# EasyEDA schematic memory-game.json
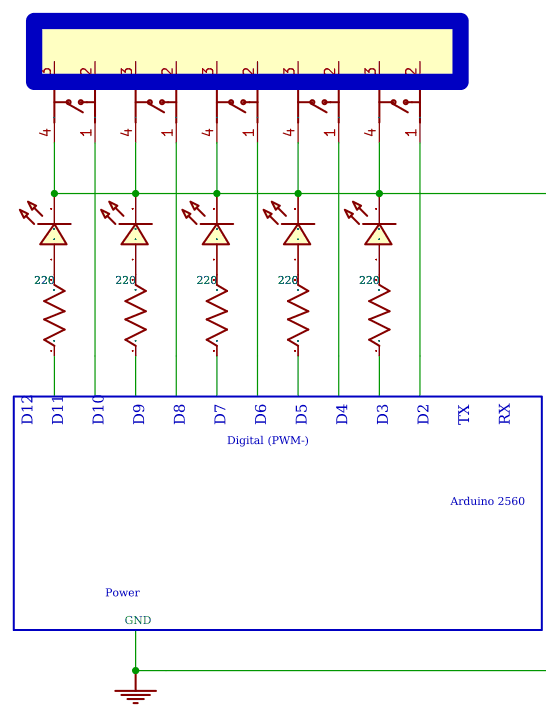
[diagram p0: schematic sheet]

## Parts
KEY1  button6*6*8  [KEY-TH_4P-L6.0-W6.0-P4.50-LS7.5]
KEY2  button6*6*8  [KEY-TH_4P-L6.0-W6.0-P4.50-LS7.5]
KEY3  button6*6*8  [KEY-TH_4P-L6.0-W6.0-P4.50-LS7.5]
KEY4  button6*6*8  [KEY-TH_4P-L6.0-W6.0-P4.50-LS7.5]
KEY5  button6*6*8  [KEY-TH_4P-L6.0-W6.0-P4.50-LS7.5]
LED1  LED-0603_R  [LED0603_RED]
LED2  LED-0603_R  [LED0603_RED]
LED3  LED-0603_R  [LED0603_RED]
LED4  LED-0603_R  [LED0603_RED]
LED5  LED-0603_R  [LED0603_RED]
R1  220  [R0603]
R2  220  [R0603]
R3  220  [R0603]
R4  220  [R0603]
R5  220  [R0603]

## Library data of the parts
KEY1-KEY5 = button6*6*8: Supplier Part: C59982; Supplier: LCSC; Manufacturer: ReliaPro
LED1-LED5 = LED-0603_R: Manufacturer: EVERLIGHT(台湾亿光); Manufacturer Part: 19-217/R6C-AL1M2VY/3T; Supplier Part: C72044; Supplier: LCSC; Contributor: LCEDA_01
R1-R5 = R_0603_US: Contributor: LCEDA_Lib

## Nets
GND: KEY1.4 KEY2.4 KEY3.4 KEY4.4 KEY5.4 LED1.2 LED2.2 LED3.2 LED4.2 LED5.2
Net-(LED1-1): LED1.1 R1.2
Net-(LED2-1): LED2.1 R5.2
Net-(LED3-1): LED3.1 R4.2
Net-(LED4-1): LED4.1 R3.2
Net-(LED5-1): LED5.1 R2.2

Not connected (* = marked no-connect by the designer): KEY1 1 2 3; KEY2 1 2 3; KEY3 1 2 3; KEY4 1 2 3; KEY5 1 2 3; R1 1; R2 1; R3 1; R4 1; R5 1

## Notes on the sheet
- D12
- D11
- D10
- D9
- D8
- D7
- D6
- D5
- D4
- D3
- D2
- TX
- RX
- Digital (PWM-)
- Arduino 2560
- Power
